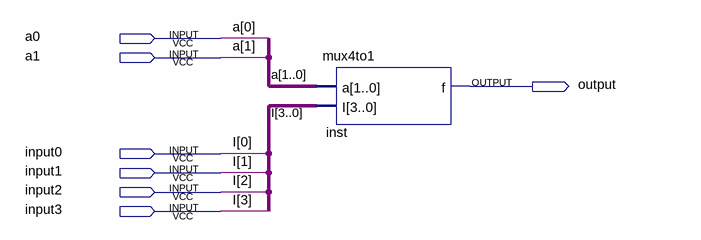
[diagram p0: schematic sheet]
// Quartus schematic Multiplexer.bdf as structural Verilog: 1 symbols, 7 pins
module Multiplexer (
  input  a0,
  input  a1,
  input  input0,
  input  input1,
  input  input2,
  input  input3,
  output \output 
);

  mux4to1 inst (.a({a1, a0}), .I({input3, input2, input1, input0}), .f(\output ));

  // Other names for the same wires on the sheet: I[3:0] = {input3, input2, input1, input0}
endmodule
